# EAGLE design CPB_Cassette_Out (EAGLE 9.6.2)
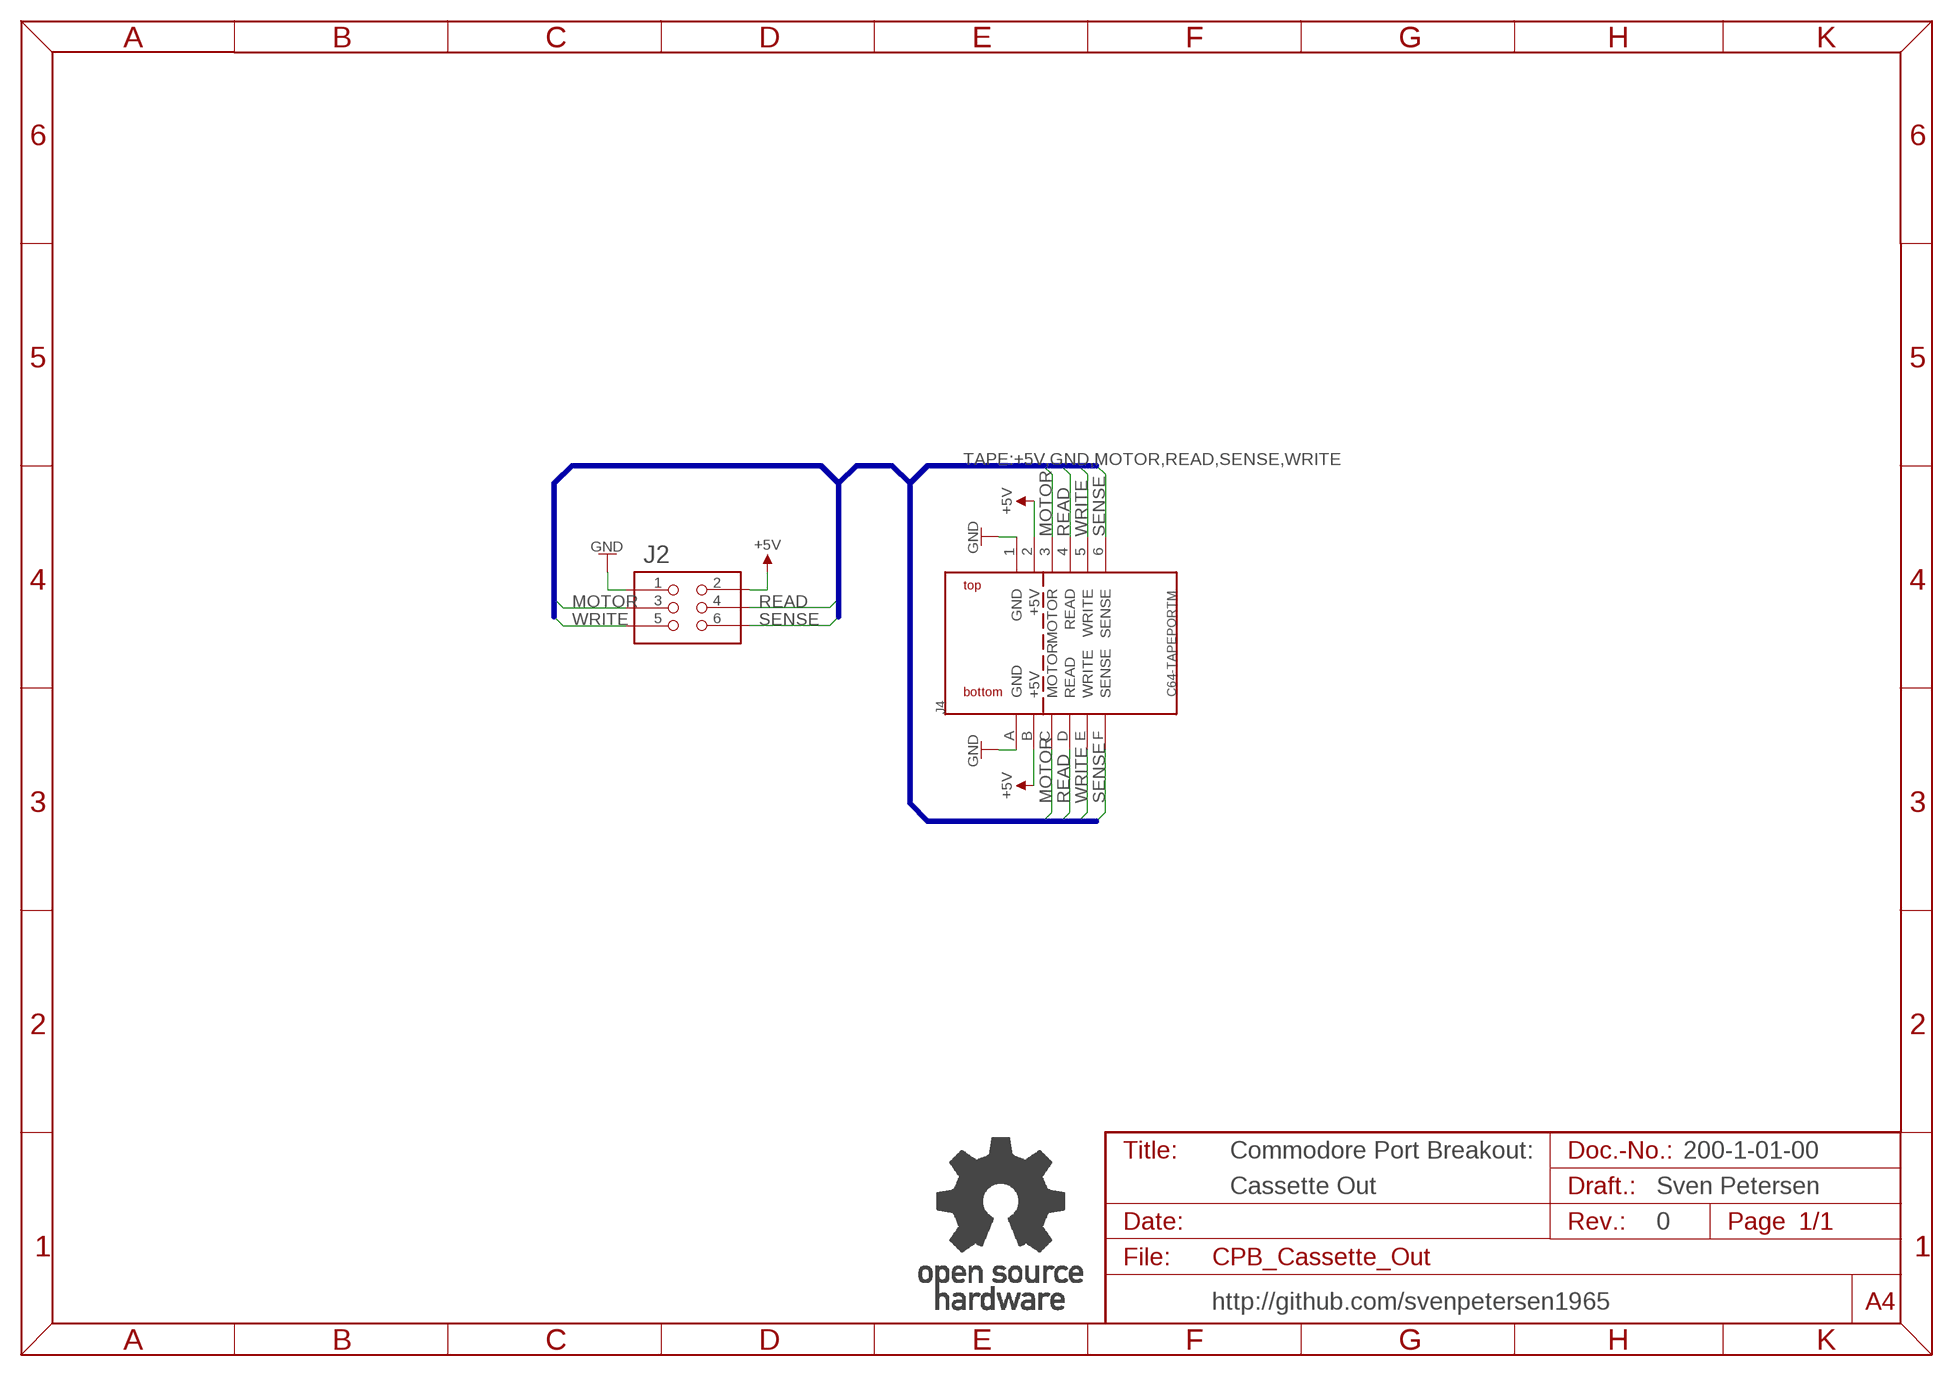
[diagram p0: schematic, sheet 1]

## Parts
J2  2X03WV  [2X03WV]
J4  C64-TAPEPORTM  [TAPEPORT_M]
U$18  OPEN_SOURCE_HW  [OPENHW]

## Nets
+5V: J2.2 J4.2(+5V) J4.B(+5V)
GND: J2.1 J4.1(GND) J4.A(GND)
MOTOR: J2.3 J4.3(MOTOR) J4.C(MOTOR)
READ: J2.4 J4.4(READ) J4.D(READ)
SENSE: J2.6 J4.6(SENSE) J4.F(SENSE)
WRITE: J2.5 J4.5(WRITE) J4.E(WRITE)

## Buses
TAPE:+5V,GND,MOTOR,READ,SENSE,WRITE

## Notes on the sheet
- Commodore Port Breakout: | 200-1-01-00
- Cassette Out | Sven Petersen
- 0
- http://github.com/svenpetersen1965

## Library data of the parts
J2 = PINHEAD:2X03WV
J4 = Commodore:C64-TAPEPORT
U$18 = Logo:OPEN_SOURCE_HW

## Board
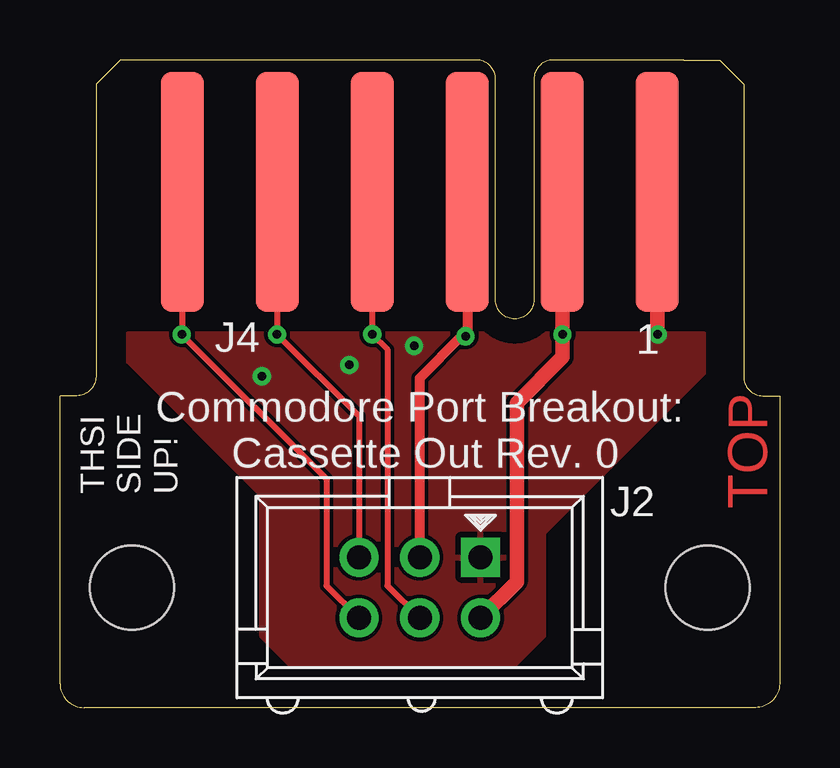
[diagram p1: board, top side]
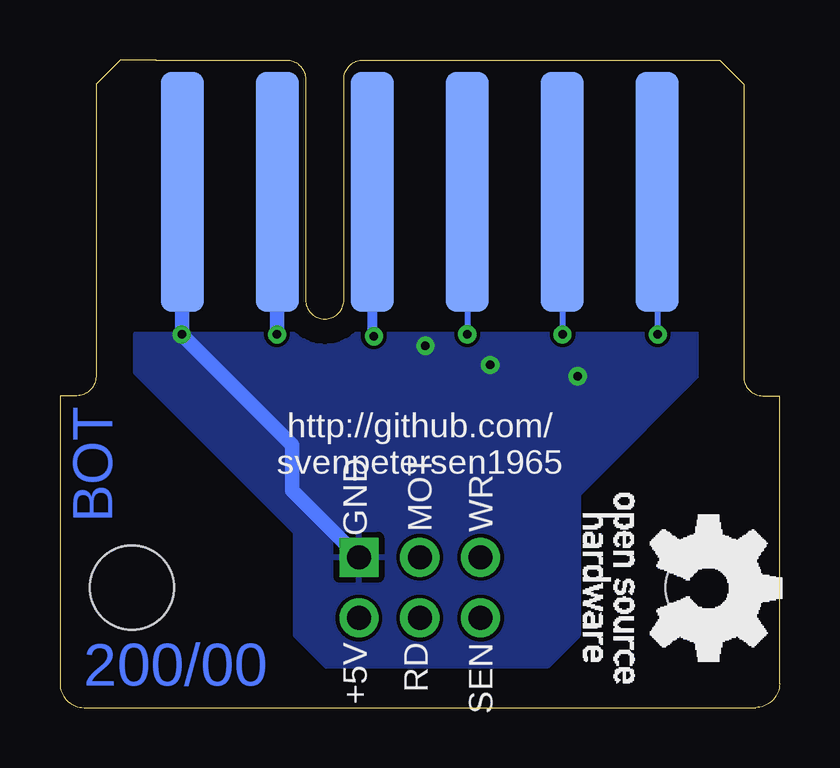
[diagram p2: board, bottom side, seen from below]

Size 30 x 27 mm. Coordinates in mm from the lower left corner, seen from the top.
Outline: 28.5,15 28.5,13.8 arc90 29.3,13 30,13 30,1 arc-90 29,0 1,0 arc-90 0,1 0,13 0.7,13 arc90 1.5,13.8 1.5,15
Copper layers (1*16): Top 0.035mm / dielectric 1.5mm / Bottom 0.035mm
Design rules "default *": minimum track width 6mil, minimum drill 0.35mm, track to track 6mil, track to pad 6mil, pad to pad 6mil, via to via 6mil, smd to smd 6mil, copper to edge 40mil, drill to drill 6mil, minimum pad ring 10mil, minimum via ring 8mil, stop-mask expansion 4mil, vias tented up to drill 24mil, thermal gap 10mil
Holes 3.5 mm at 3,5 27,5
bRestrict: 2 lines

### Footprints (pad centres in the part's own frame; a part is rotated, then mirrored left to right if it is on the bottom)
2X03WV = drill 1 pad 1.626 square: 1 -2.54,-1.27 | drill 1 pad 1.626: 2 -2.54,1.27; 3 0,-1.27; 4 0,1.27; 5 2.54,-1.27; 6 2.54,1.27
TAPEPORT_M = smd 1.8 x 10: 1 -9.9,5.5; 2 -5.94,5.5; 3 -1.98,5.5; 4 1.98,5.5; 5 5.94,5.5; 6 9.9,5.5 | smd 1.8 x 10 bottom: A -9.9,5.5; B -5.94,5.5; C -1.98,5.5; D 1.98,5.5; E 5.94,5.5; F 9.9,5.5

### Placement (x,y rotation side)
J2  15,5 180 top
J4  15,27 180 top
U$5  [PCB-TITLE/]  -0.14,38.02 0 top  (outside the outline)
U$6  [2LAYER]  29.49,8.28 90 top
U$18  8.18,8.91 270 bottom

### Tracks (layer width: path | path; a pad name or v marks a point on that pad's centre or on a via)
+5V  (via drill 0.35)
  Top 0.61: J4.B 20.94,15.57 v20.95,15.56 20.95,14.61 19.05,12.7 19.05,5.24 J2.2
  Bottom 0.61: v20.95,15.56 20.94,15.57 J4.B
GND  (via drill 0.35)
  Top 0.61: J4.A 24.9,15.58 v24.92,15.56
  Bottom 0.61: J4.A 24.9,15.58 v24.92,15.56 20.32,10.95 20.32,9.05 J2.1
  other vias: 8.41,13.81 12.06,14.29 14.76,15.08
  pour Bottom: 2.86,15.4 2.86,14.45 8.41,8.89 8.41,3.02 9.68,1.75 18.89,1.75 20.16,3.02 20.16,7.3 26.83,13.97 26.83,15.56 2.86,15.56
  pour Top: 2.86,15.56 2.86,14.45 8.41,8.89 8.41,3.02 9.68,1.75 18.89,1.75 20.16,3.02 20.16,7.3 26.83,13.97 26.83,15.56
MOTOR  (via drill 0.35)
  Top 0.406: J2.3 15,13.73 16.75,15.48 v16.91,15.48 16.98,15.55 J4.3
  Bottom 0.406: J4.3 16.98,15.56 16.99,15.56 v16.91,15.48
READ  (via drill 0.35)
  Top 0.254: J4.4 v13.02,15.56 13.65,14.93 13.65,5.08 J2.4
  Bottom 0.254: J4.4 v13.02,15.56
SENSE  (via drill 0.35)
  Top 0.254: J2.6 11.11,5.08 11.11,9.53 v5.08,15.56 5.1,15.58 J4.6
  Bottom 0.254: v5.08,15.56 5.1,15.58 J4.6
WRITE  (via drill 0.35)
  Top 0.254: J4.5 v9.06,15.57 v9.05,15.56 12.46,12.15 J2.5
  Bottom 0.254: J4.5 v9.06,15.57 v9.05,15.56

### Text on the board
Bottom: 200/00
tPlace: Commodore Port Breakout: / Cassette Out Rev. 0 | THSI / SIDE / UP!
bPlace: http://github.com/ / svenpetersen1965 | WR | MOT | GND | SEN | RD | +5V
Document: Sven Petersen | 200-2-01-00 | 2022 | 35µm | 2 | 0